# EAGLE design mmc_r (EAGLE 5.06)
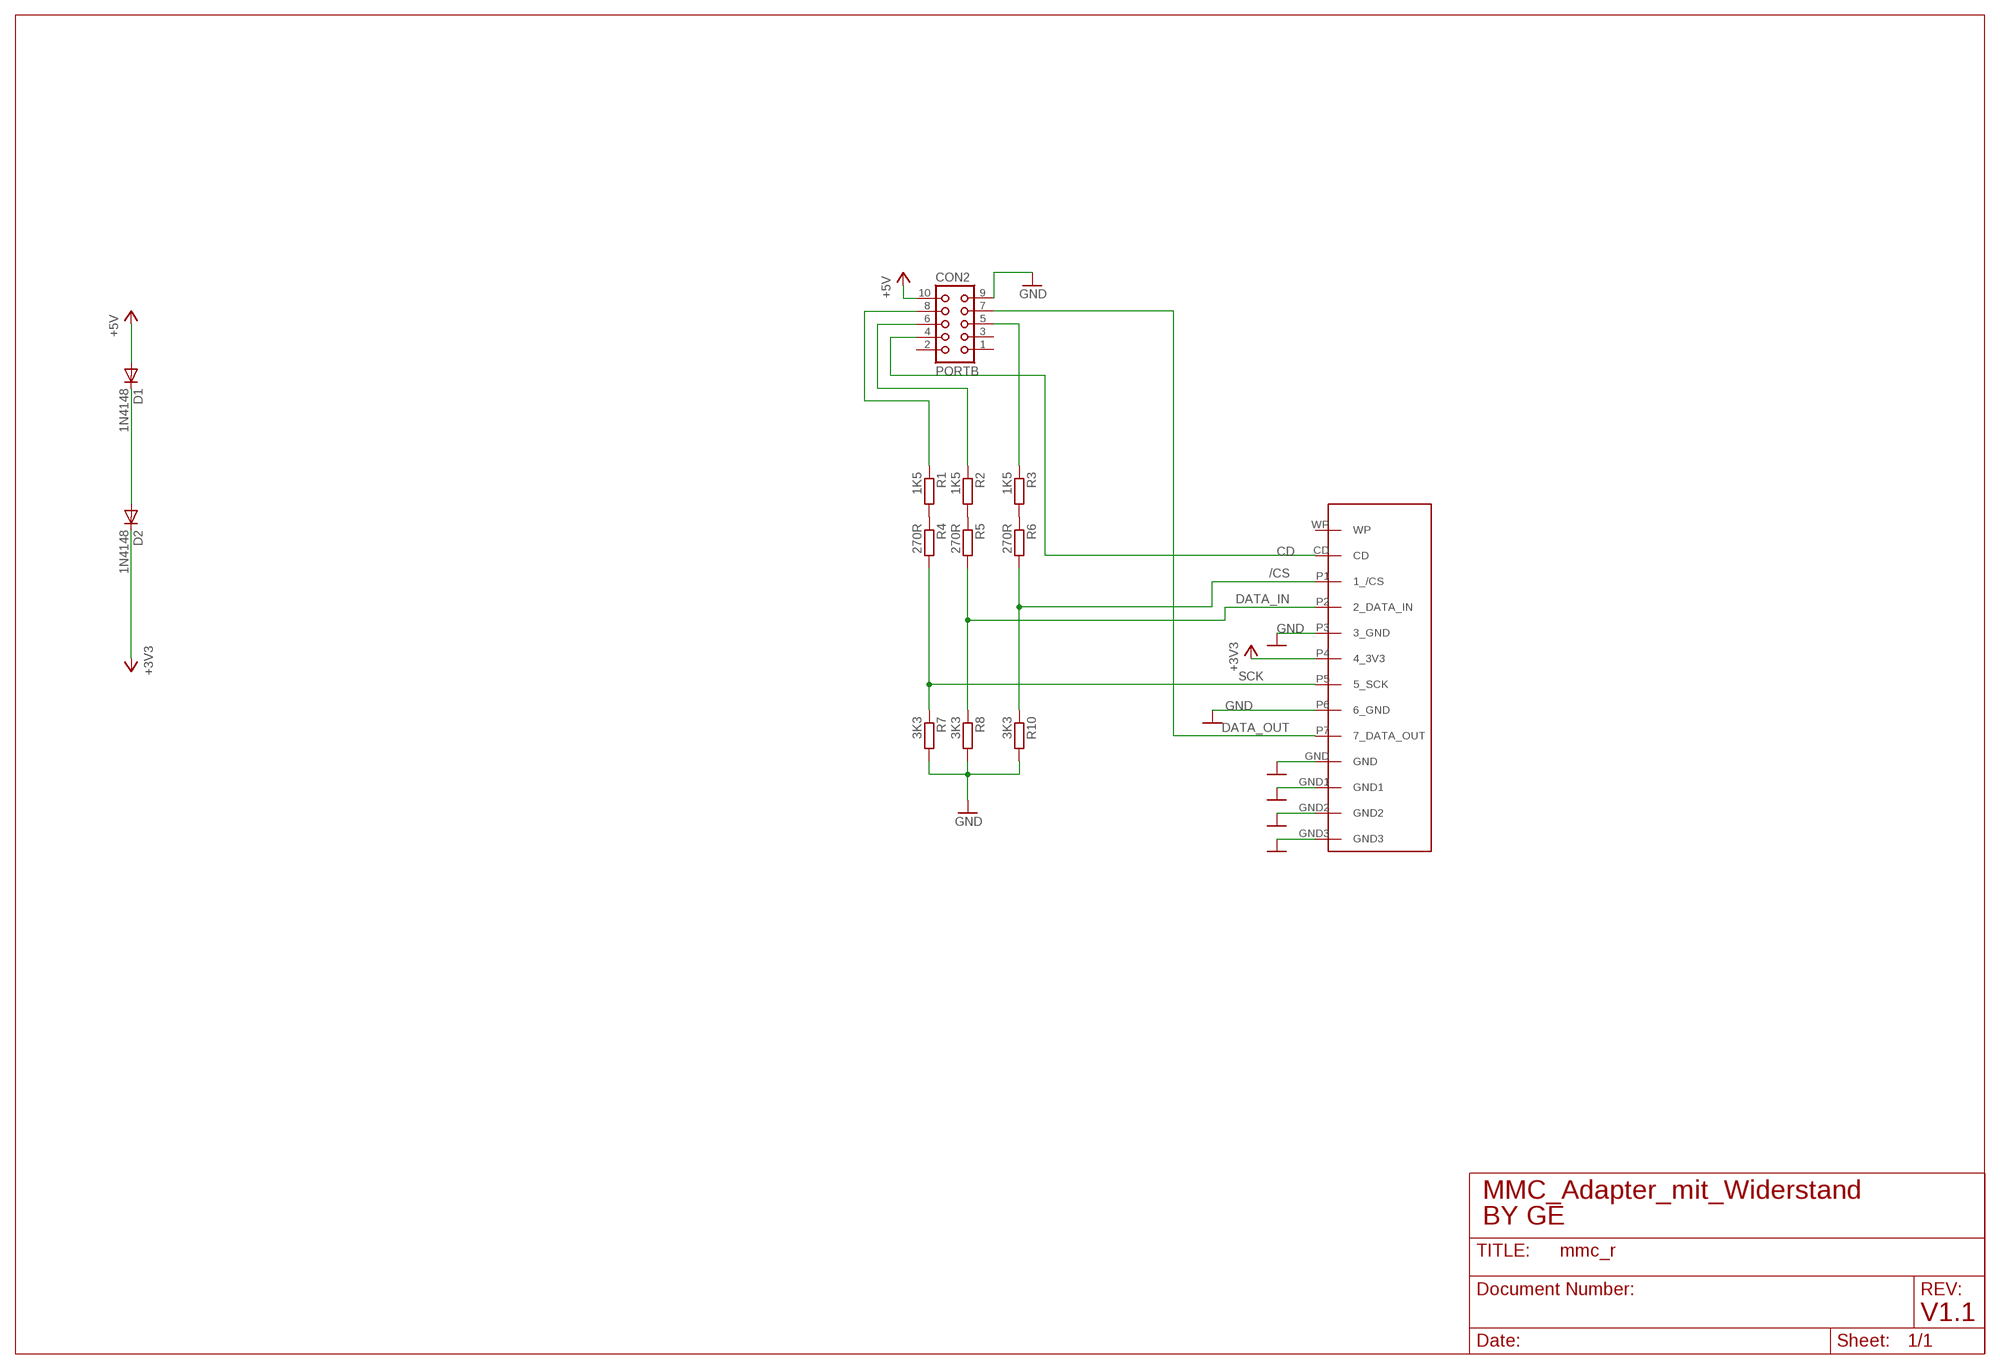
[diagram p0: schematic, sheet 1]

## Parts
CON2  PORTB  CON10  [CON10]
D1  1N4148  1N4148DO35-7  [DO35-7]
D2  1N4148  1N4148DO35-7  [DO35-7]
R1  1K5  R-EU_0207/10  [0207/10]
R2  1K5  R-EU_0204/2V  [0204V]
R3  1K5  R-EU_0204/2V  [0204V]
R4  270R  R-EU_0204/7  [0204/7]
R5  270R  R-EU_0204/2V  [0204V]
R6  270R  R-EU_0204/2V  [0204V]
R7  3K3  R-EU_0204/7  [0204/7]
R8  3K3  R-EU_0204/2V  [0204V]
R10  3K3  R-EU_0204/2V  [0204V]
U$1  SD_CARD1  [SD_MEM1055]

## Nets
+3V3: D2.C U$1.P4(4_3V3)
+5V: CON2.10 D1.A
/CS: R6.2 R10.1 U$1.P1(1_/CS)
CD: CON2.4 U$1.CD
DATA_IN: R5.2 R8.1 U$1.P2(2_DATA_IN)
DATA_OUT: CON2.7 U$1.P7(7_DATA_OUT)
GND: CON2.9 R7.2 R8.2 R10.2 U$1.GND U$1.GND1 U$1.GND2 U$1.GND3 U$1.P3(3_GND) U$1.P6(6_GND)
N$1: D1.C D2.A
N$3: R1.2 R4.1
N$4: R2.2 R5.1
N$5: CON2.5 R3.1
N$6: CON2.6 R2.1
N$7: CON2.8 R1.1
N$8: R3.2 R6.1
SCK: R4.2 R7.1 U$1.P5(5_SCK)
Unconnected: CON2.1 CON2.2 CON2.3 U$1.WP

## Notes on the sheet
- MMC_Adapter_mit_Widerstand
- BY GE
- V1.1

## Library data of the parts
CON2 = con-harting:CON10: CONNECTOR
D1 D2 = diode:1N4148: DIODE high speed (Philips)
R1-R8 R10 = rcl:R-EU_: RESISTOR, European symbol
U$1 = ge01:SD_CARD1

## Board
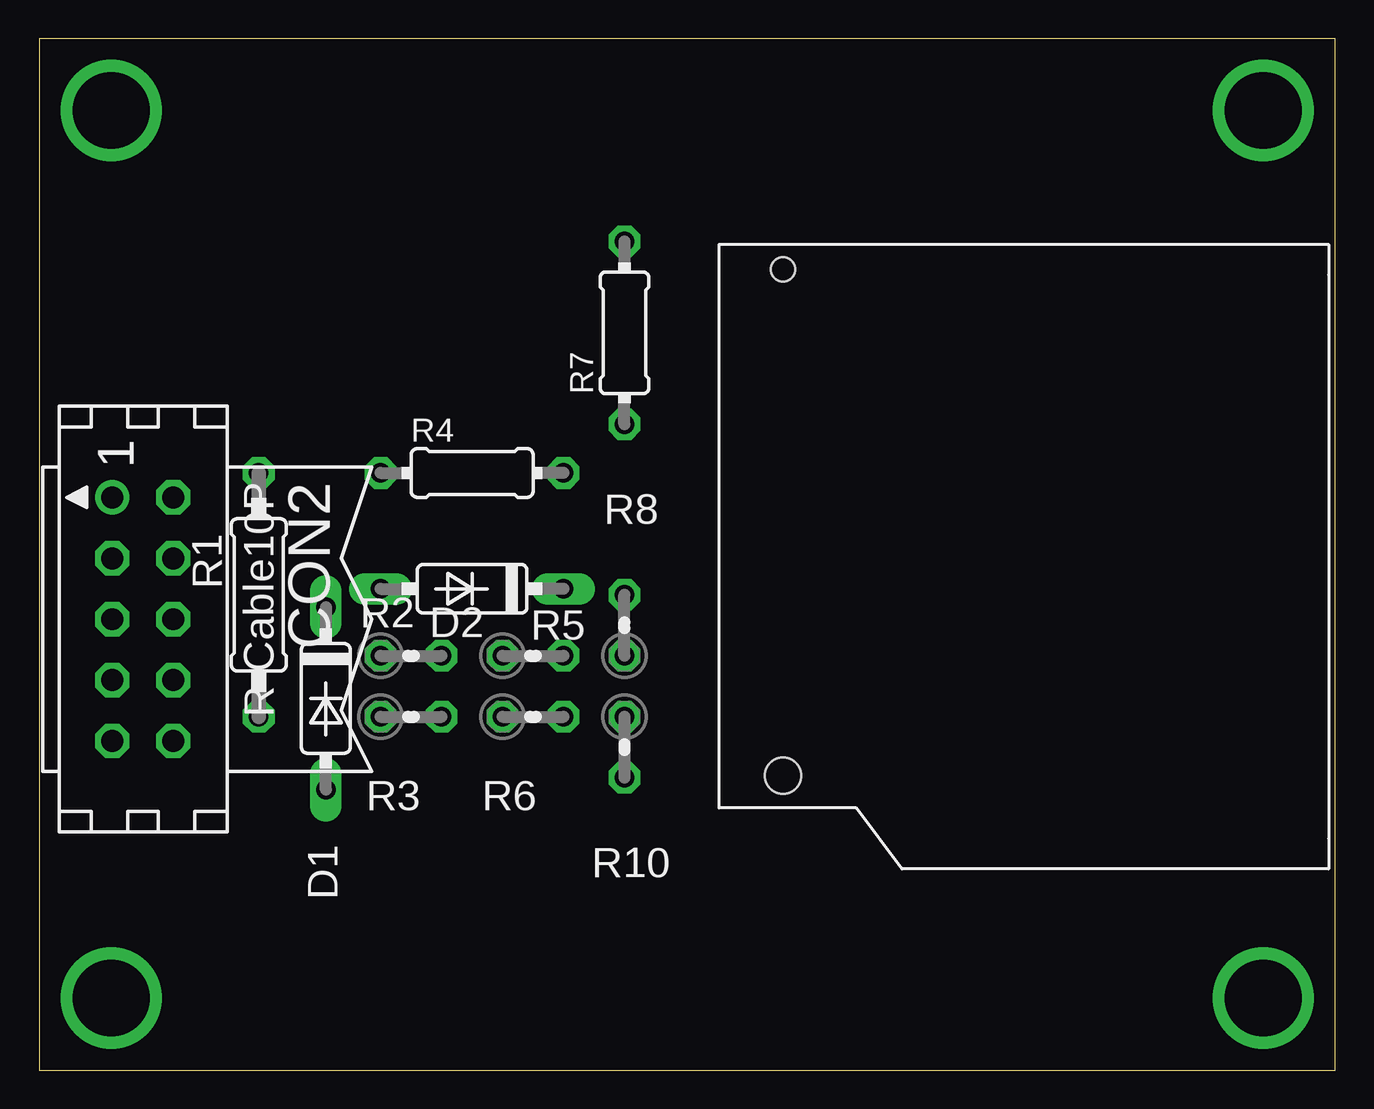
[diagram p1: board, top side]
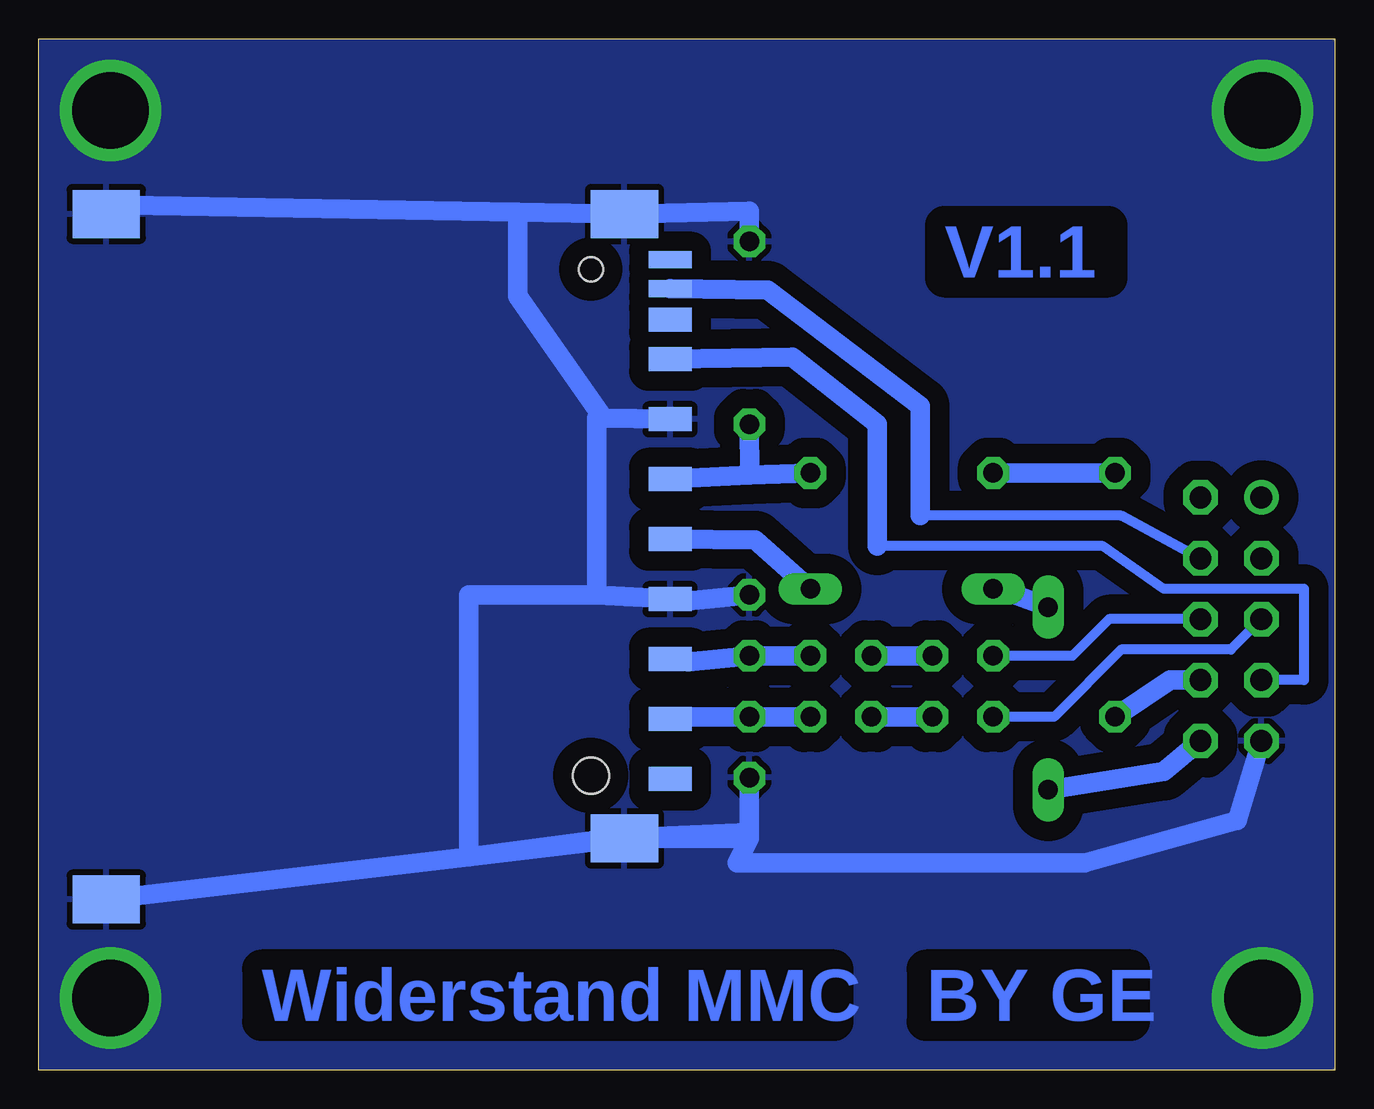
[diagram p2: board, bottom side, seen from below]

No outline drawn. Coordinates in mm, seen from the top.
Copper layers (1*16): Top 0.035mm / dielectric 1.5mm / Bottom 0.035mm
Design rules "0.3mm": minimum track width 10mil, minimum drill 24mil, track to track 0.3mm, track to pad 0.3mm, pad to pad 0.3mm, via to via 0.3mm, smd to smd 0.3mm, copper to edge 0mil, drill to drill 8mil, minimum pad ring 10mil, minimum via ring 8mil, stop-mask expansion 4mil, vias tented up to drill 0mil, thermal gap 10mil
Milling: 4 lines

### Footprints (pad centres in the part's own frame; a part is rotated, then mirrored left to right if it is on the bottom)
CON10 = drill 0.914 round: 1 -5.08,-1.27 | drill 0.914 octagon: 2 -5.08,1.27; 3 -2.54,-1.27; 4 -2.54,1.27; 5 0,-1.27; 6 0,1.27; 7 2.54,-1.27; 8 2.54,1.27; 9 5.08,-1.27; 10 5.08,1.27
DO35-7 = drill 0.813 long: A 3.81,0; C -3.81,0
0207/10 = drill 0.813 octagon: 1 -5.08,0; 2 5.08,0
0204V = drill 0.813 octagon: 1 -1.27,0; 2 1.27,0
0204/7 = drill 0.813 octagon: 1 -3.81,0; 2 3.81,0
SD_MEM1055 = smd 0.7 x 1.8: CD 1.2,0; WP 0,0 | smd 2 x 2.8: GND -1.905,-1.905; GND1 -1.905,-23.495; GND2 24.13,-1.905; GND3 26.67,-23.495 | smd 1 x 1.8: P1 19.15,0; P2 16.65,0; P3 14.15,0; P4 11.65,0; P5 9.15,0; P6 6.65,0; P7 4.15,0; P8 2.5,0; P9 21.65,0 | hole 1: 0.4,-3.3 | hole 1.5: 21.5,-3.3

### Placement (x,y rotation side)
CON2  4.32,18.8 270 top
D1  11.94,15.49 270 top
D2  18.03,20.07 180 top
R1  9.14,19.81 90 top
R2  15.49,17.27 0 top
R3  15.49,14.73 0 top
R4  18.03,24.89 0 top
R5  20.57,17.27 0 top
R6  20.57,14.73 0 top
R7  24.38,30.73 90 top
R8  24.38,18.54 90 top
R10  24.38,13.46 270 top
U$1  27.69,33.78 270 bottom

### Tracks (layer width: path | path; a pad name or v marks a point on that pad's centre or on a via)
+3V3
  Bottom 0.813: D2.C 24.13,22.1 U$1.P4
+5V
  Bottom 0.813: CON2.10 7.11,12.45 D1.A
/CS
  Bottom 0.813: R6.2 R10.1 26.92,14.73 U$1.P1
CD
  Bottom 0.406: CON2.4 8.89,23.11 17.27,23.11
  Bottom 0.813: 17.27,23.11 17.27,27.69 23.62,32.51 U$1.CD
DATA_IN
  Bottom 0.813: R5.2 R8.1 26.92,17.02 U$1.P2
DATA_OUT
  Bottom 0.406: 19.05,21.84 9.65,21.84 7.11,20.07 1.27,20.07 1.27,16.26 CON2.7
  Bottom 0.813: U$1.P7 22.61,29.72 19.05,26.92 19.05,21.84
GND  (via drill 3.2)
  Bottom 0.813: 24.38,9.65 24.38,9.91 | 24.38,9.65 U$1.GND2 36.07,8.89 | R8.2 26.92,19.56 U$1.P3 30.73,19.81 | 36.07,8.89 U$1.GND3 | 34.03,35.76 U$1.GND 24.38,35.81 R7.2 | 34.03,35.76 51.56,36.07 U$1.GND1 | 30.73,19.81 30.73,27.18 U$1.P6 30.48,27.18 34.04,32.26 34.03,35.76 | CON2.9 4.06,10.41 10.41,8.64 24.89,8.64 24.38,9.65 | 24.38,9.91 R10.2 | 24.38,9.91 30.23,9.65 36.07,8.89 | 36.07,8.89 36.07,19.81 30.73,19.81
  other vias: 3,40 3,3 51,3 51,40
  pour Bottom (isolate 0.813): 0,0 54,0 54,43 0,43
N$1
  Bottom 0.813: D2.A 13.97,20.07 D1.C
N$3
  Bottom 0.813: R1.2 R4.1
N$4
  Bottom 0.813: R2.2 R5.1
N$5
  Bottom 0.406: R3.1 11.68,14.73 8.89,17.53 4.32,17.53 CON2.5
N$6
  Bottom 0.406: CON2.6 9.4,18.8 10.92,17.27 R2.1
N$7
  Bottom 0.813: CON2.8 6.86,16.26 R1.1
N$8
  Bottom 0.813: R3.2 R6.1
SCK
  Bottom 0.813: R4.2 24.36,24.8 | 24.36,24.8 U$1.P5 | 24.36,24.8 R7.1

### Text on the board
Bottom: V1.1 | BY GE | Widerstand MMC